# EAGLE design relay_8_v04 (EAGLE 5.11)
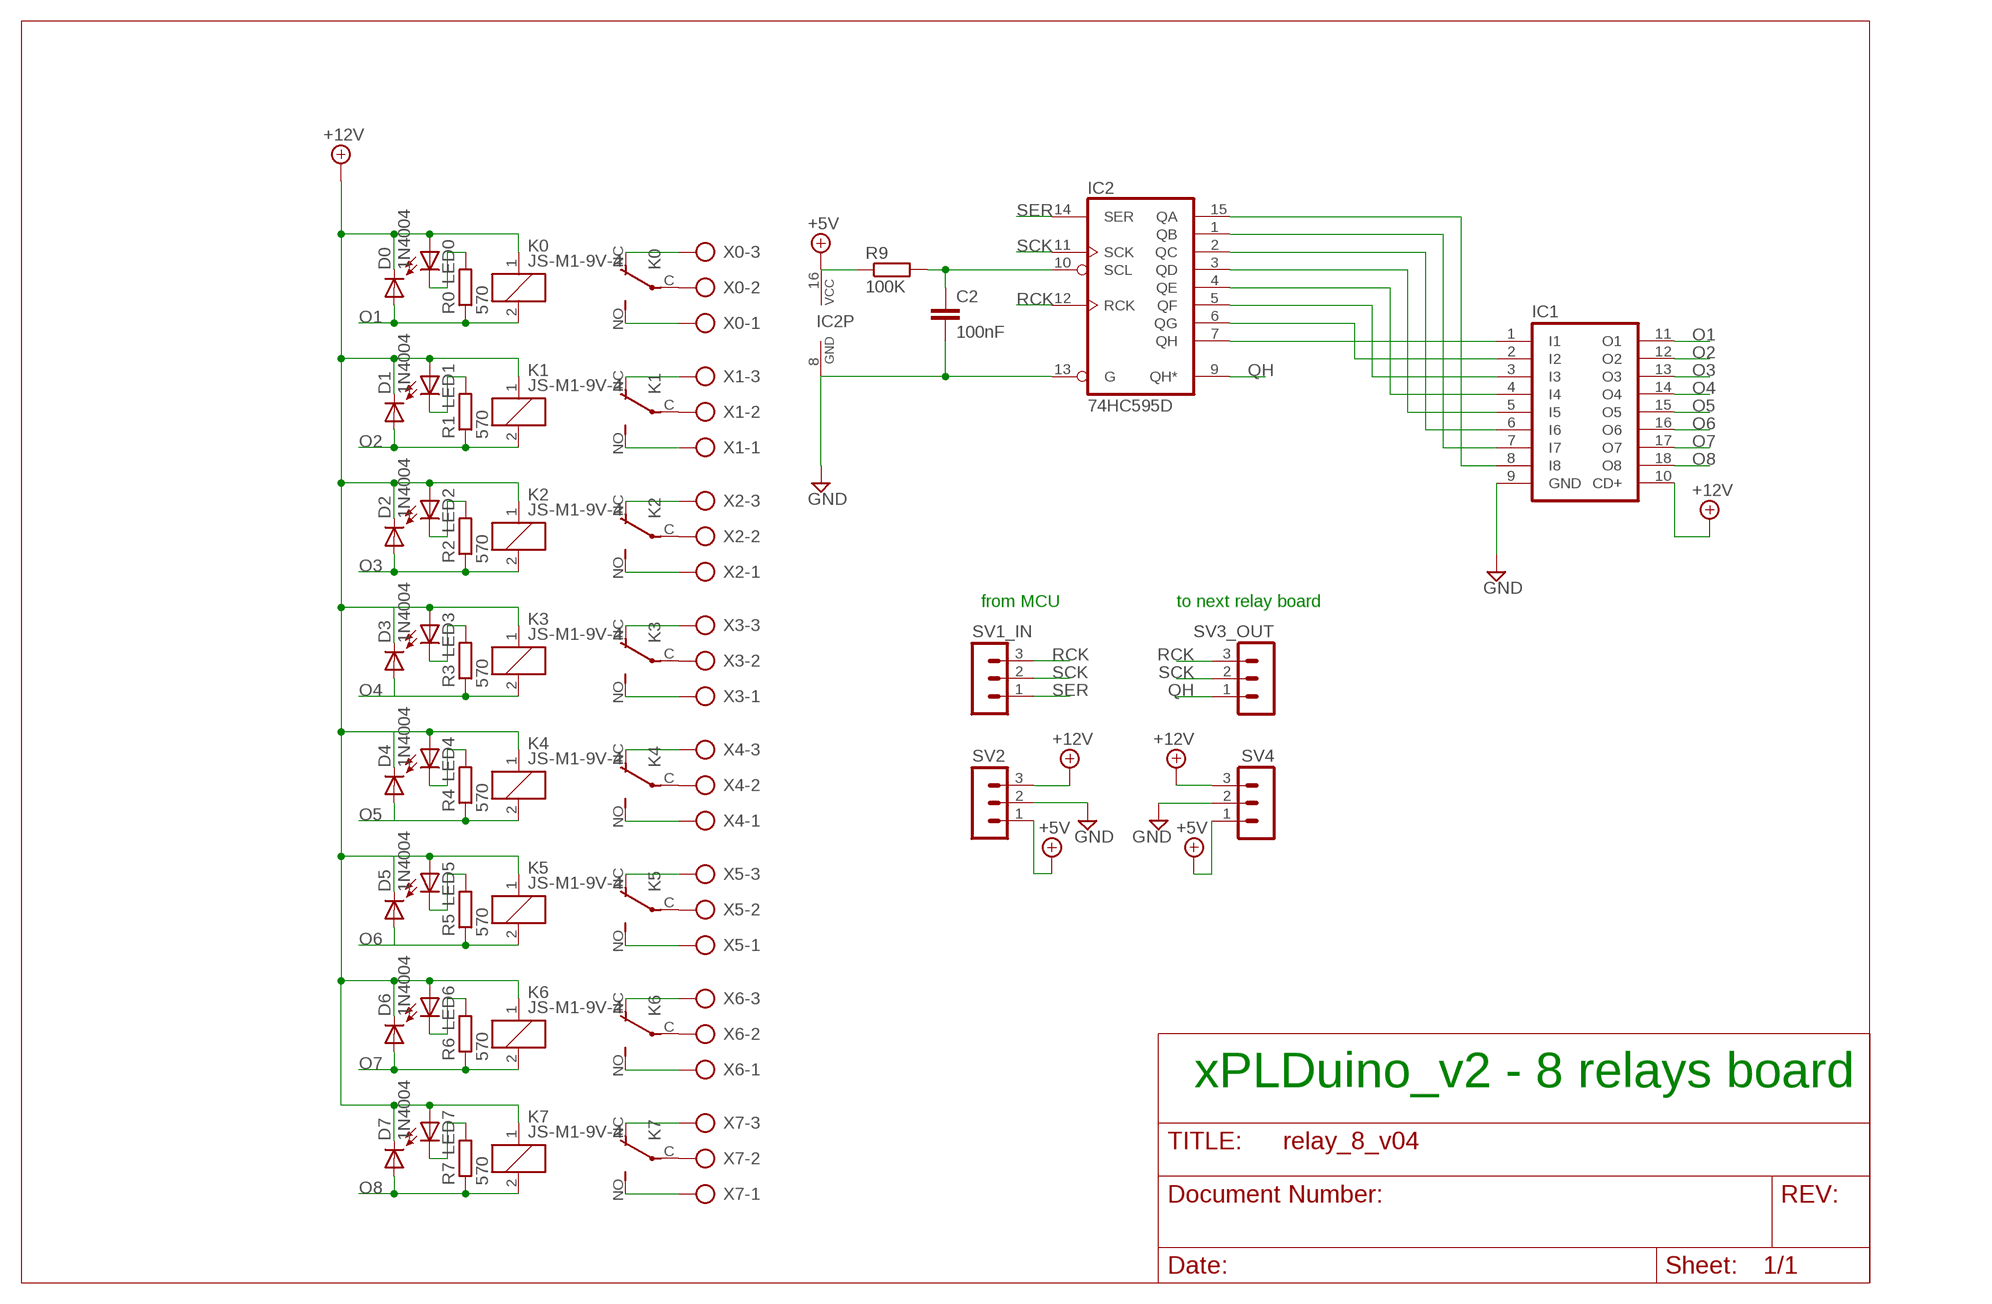
[diagram p0: schematic, sheet 1]

## Parts
C2  100nF  C-EU025-025X050  [C025-025X050]
D0  1N4004  [DO41-10]
D1  1N4004  [DO41-10]
D2  1N4004  [DO41-10]
D3  1N4004  [DO41-10]
D4  1N4004  [DO41-10]
D5  1N4004  [DO41-10]
D6  1N4004  [DO41-10]
D7  1N4004  [DO41-10]
IC1  ULN2803ASO18  [SO18W]
IC2  74HC595D  [SO16]
K0  JS-M1-9V-4  [JS-M]
K1  JS-M1-9V-4  [JS-M]
K2  JS-M1-9V-4  [JS-M]
K3  JS-M1-9V-4  [JS-M]
K4  JS-M1-9V-4  [JS-M]
K5  JS-M1-9V-4  [JS-M]
K6  JS-M1-9V-4  [JS-M]
K7  JS-M1-9V-4  [JS-M]
LED0  LED3MM  [LED3MM]
LED1  LED3MM  [LED3MM]
LED2  LED3MM  [LED3MM]
LED3  LED3MM  [LED3MM]
LED4  LED3MM  [LED3MM]
LED5  LED3MM  [LED3MM]
LED6  LED3MM  [LED3MM]
LED7  LED3MM  [LED3MM]
R0  570  R-EU_0207/2V  [0207/2V]
R1  570  R-EU_0207/2V  [0207/2V]
R2  570  R-EU_0207/2V  [0207/2V]
R3  570  R-EU_0207/2V  [0207/2V]
R4  570  R-EU_0207/2V  [0207/2V]
R5  570  R-EU_0207/2V  [0207/2V]
R6  570  R-EU_0207/2V  [0207/2V]
R7  570  R-EU_0207/2V  [0207/2V]
R9  100K  R-EU_0204/5  [0204/5]
SV1_IN  MA03-1  [MA03-1]
SV2  MA03-1  [MA03-1]
SV3_OUT  MA03-1  [MA03-1]
SV4  MA03-1  [MA03-1]
X0  AK500/3-H  [AK500/3-H]
X1  AK500/3-H  [AK500/3-H]
X2  AK500/3-H  [AK500/3-H]
X3  AK500/3-H  [AK500/3-H]
X4  AK500/3-H  [AK500/3-H]
X5  AK500/3-H  [AK500/3-H]
X6  AK500/3-H  [AK500/3-H]
X7  AK500/3-H  [AK500/3-H]

## Nets
+5V: IC2.16(VCC) R9.1 SV2.1 SV4.1
+12V: D0.C D1.C D2.C D3.C D4.C D5.C D6.C D7.C IC1.10(CD+) K0.1 K1.1 K2.1 K3.1 K4.1 K5.1 K6.1 K7.1 LED0.A LED1.A LED2.A LED3.A LED4.A LED5.A LED6.A LED7.A SV2.3 SV4.3
GND: C2.2 IC1.9(GND) IC2.8(GND) IC2.13(G) SV2.2 SV4.2
N$2: K0.C(2:P) X0.2
N$3: K0.NC(2:O) X0.3
N$4: IC1.8(I8) IC2.15(QA)
N$5: K1.NC(2:O) X1.3
N$6: K1.NO(2:S) X1.1
N$7: IC1.7(I7) IC2.1(QB)
N$8: K0.NO(2:S) X0.1
N$9: IC1.6(I6) IC2.2(QC)
N$10: IC1.5(I5) IC2.3(QD)
N$11: IC1.4(I4) IC2.4(QE)
N$12: IC1.3(I3) IC2.5(QF)
N$13: IC1.2(I2) IC2.6(QG)
N$14: IC1.1(I1) IC2.7(QH)
N$15: K1.C(2:P) X1.2
N$16: K2.NC(2:O) X2.3
N$17: K2.NO(2:S) X2.1
N$18: K2.C(2:P) X2.2
N$19: K3.NC(2:O) X3.3
N$20: K3.NO(2:S) X3.1
N$21: K3.C(2:P) X3.2
N$22: K4.NC(2:O) X4.3
N$23: K4.NO(2:S) X4.1
N$24: K4.C(2:P) X4.2
N$25: K5.NC(2:O) X5.3
N$26: K5.NO(2:S) X5.1
N$27: K5.C(2:P) X5.2
N$28: K6.NC(2:O) X6.3
N$29: K6.NO(2:S) X6.1
N$30: K6.C(2:P) X6.2
N$31: K7.NC(2:O) X7.3
N$32: K7.NO(2:S) X7.1
N$33: K7.C(2:P) X7.2
N$36: LED0.K(C) R0.2
N$37: LED1.K(C) R1.2
N$38: LED2.K(C) R2.2
N$39: LED3.K(C) R3.2
N$40: LED4.K(C) R4.2
N$41: LED5.K(C) R5.2
N$42: LED6.K(C) R6.2
N$43: LED7.K(C) R7.2
N$46: C2.1 IC2.10(SCL) R9.2
O1: D0.A IC1.11(O1) K0.2 R0.1
O2: D1.A IC1.12(O2) K1.2 R1.1
O3: D2.A IC1.13(O3) K2.2 R2.1
O4: D3.A IC1.14(O4) K3.2 R3.1
O5: D4.A IC1.15(O5) K4.2 R4.1
O6: D5.A IC1.16(O6) K5.2 R5.1
O7: D6.A IC1.17(O7) K6.2 R6.1
O8: D7.A IC1.18(O8) K7.2 R7.1
QH: IC2.9(QH*) SV3_OUT.1
RCK: IC2.12(RCK) SV1_IN.3 SV3_OUT.3
SCK: IC2.11(SCK) SV1_IN.2 SV3_OUT.2
SER: IC2.14(SER) SV1_IN.1

## Notes on the sheet
- from MCU | to next relay board
- xPLDuino_v2 - 8 relays board

## Library data of the parts
C2 = resistor:C-EU: CAPACITOR, European symbol
D0 D1-D7 = diode:1N4004: DIODE general purpose rectifier, 1 A
IC1 = xplduino-uln-udn:ULN2803A: DRIVER ARRAY
IC2 = 74xx-eu:74*595: 8-bit SHIFT REGISTER, output latch
K0 K1-K7 = relay:JS-M1*: Automotive Ultra-Miniature Power Relay NAiS Source: http://www.mew-europe.com/.. en_ds_61211_0000.pdf; OC_FARNELL: unknown; OC_NEWARK: unknown
LED0 LED1-LED7 = led:LED: LED OSRAM: - CHIPLED LG R971, LG N971, LY N971, LG Q971, LY Q971, LO R971, LY R971 LH N974, LH R974 LS Q976, LO Q976, LY Q976 LO Q996 - Hyper CHIPLED LW Q18S LB Q993, LB Q99A, LB R99A - SideLED LS A670, LO A670, LY A670, LG A670, LP A670 LB A673, LV A673, LT A673, LW A673 LH A674 LY A675 LS A676, LA A676, LO A676, LY A676, LW A676 LS A679, LY A679, LG A679 - Hyper Micro SIDELED® LS Y876, LA Y876, LO Y876, LY Y876 LT Y87S - SmartLED LW L88C, LW L88S LB L89C, LB L89S, LG L890 LS L89K, LO L89K, LY L89K LS L896, LA L896, LO L896, LY L896 - TOPLED LS T670, LO T670, LY T670, LG T670, LP T670 LSG T670, LSP T670, LSY T670, LOP T670, LYG T670 LG T671, LOG T671, LSG T671 LB T673, LV T673, LT T673, LW T673 LH T674 LS T676, LA T676, LO T676, LY T676, LB T676, LH T676, LSB T676, LW T676 LB T67C, LV T67C, LT T67C, LS T67K, LO T67K, LY T67K, LW E67C LS E67B, LA E67B, LO E67B, LY E67B, LB E67C, LV E67C, LT E67C LW T67C LS T679, LY T679, LG T679 LS T770, LO T770, LY T770, LG T770, LP T770 LB T773, LV T773, LT T773, LW T773 LH T774 LS E675, LA E675, LY E675, LS T675 LS T776, LA T776, LO T776, LY T776, LB T776 LHGB T686 LT T68C, LB T68C - Hyper Mini TOPLED® LB M676 - Mini TOPLED Santana® LG M470 LS M47K, LO M47K, LY M47K Source: http://www.osram.convergy.de LUXEON: - LUMILED® LXK2-PW12-R00, LXK2-PW12-S00, LXK2-PW14-U00, LXK2-PW14-V00 LXK2-PM12-R00, LXK2-PM12-S00, LXK2-PM14-U00 LXK2-PE12-Q00, LXK2-PE12-R00, LXK2-PE12-S00, LXK2-PE14-T00, LXK2-PE14-U00 LXK2-PB12-K00, LXK2-PB12-L00, LXK2-PB12-M00, LXK2-PB14-N00, LXK2-PB14-P00, LXK2-PB14-Q00 LXK2-PR12-L00, LXK2-PR12-M00, LXK2-PR14-Q00, LXK2-PR14-R00 LXK2-PD12-Q00, LXK2-PD12-R00, LXK2-PD12-S00 LXK2-PH12-R00, LXK2-PH12-S00 LXK2-PL12-P00, LXK2-PL12-Q00, LXK2-PL12-R00 Source: www.luxeon.com KINGBRIGHT: KA-3528ASYC Source: www.kingbright.com
R0 R1-R7 R9 = resistor:R-EU_: RESISTOR, European symbol
SV1_IN SV2 SV3_OUT SV4 = con-lstb:MA03-1: PIN HEADER; OC_FARNELL: unknown; OC_NEWARK: unknown
X0 X1-X7 = con-ptr500:AK500/3-H: CONNECTOR Aug. 2004 / PTR Meßtechnik: Die Bezeichnung der Serie AK505 wurde geändert. Es handelt sich hierbei um AK500 in horizontaler Ausführung.; OC_FARNELL: unknown; OC_NEWARK: unknown

## Board
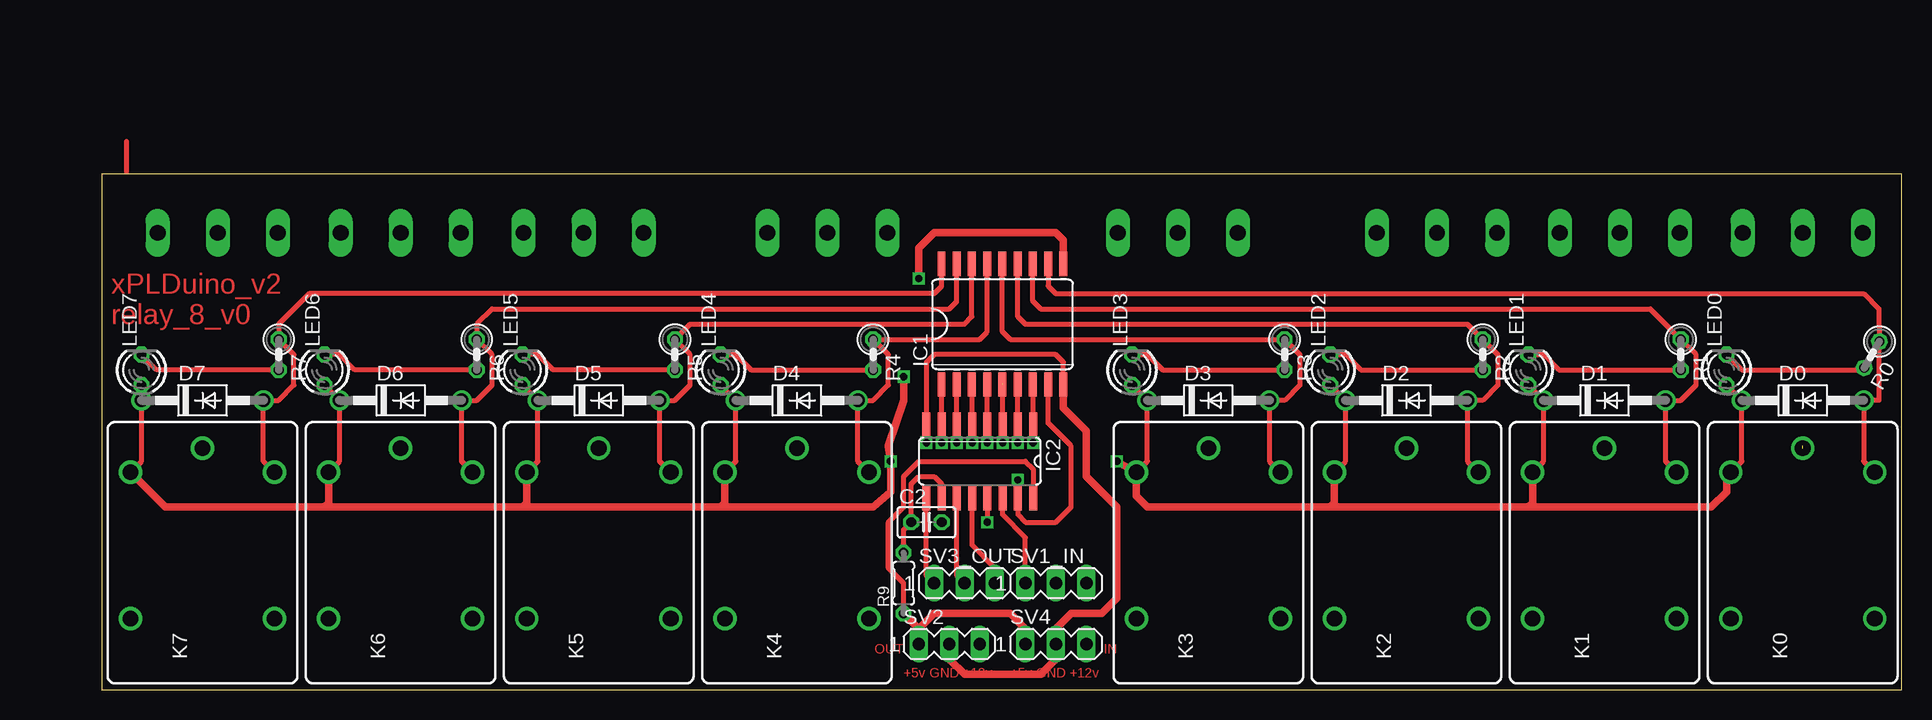
[diagram p1: board, top side]
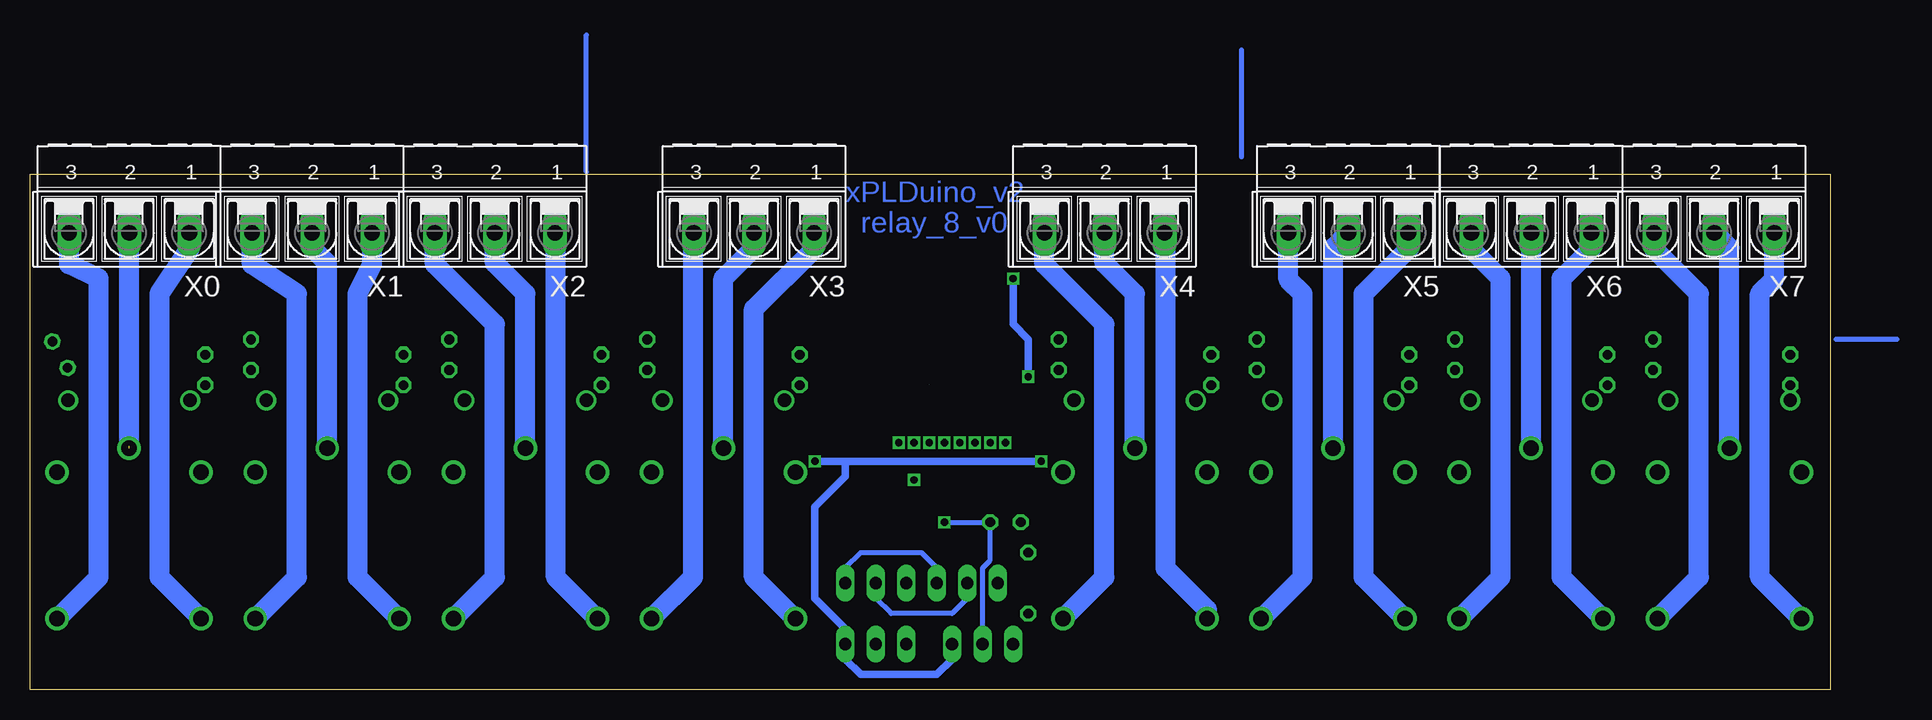
[diagram p2: board, bottom side, seen from below]

Size 150 x 43 mm. Coordinates in mm from the lower left corner, seen from the top.
Outline: 0,0 150,0 150,43 0,43 0,0
Copper layers (1*16): Top 0.035mm / dielectric 1.5mm / Bottom 0.035mm
Design rules "default": minimum track width 10mil, minimum drill 24mil, track to track 8mil, track to pad 8mil, pad to pad 8mil, via to via 8mil, smd to smd 8mil, copper to edge 40mil, drill to drill 8mil, minimum pad ring 10mil, minimum via ring 8mil, stop-mask expansion 4mil, vias tented up to drill 0mil, thermal gap 10mil

### Footprints (pad centres in the part's own frame; a part is rotated, then mirrored left to right if it is on the bottom)
C025-025X050 = drill 0.813 octagon: 1 -1.27,0; 2 1.27,0
DO41-10 = drill 1.118 round: A 5.08,0; C -5.08,0
SO18W = smd 0.66 x 2.032: 1 -5.08,-5.029; 2 -3.81,-5.029; 3 -2.54,-5.029; 4 -1.27,-5.029; 5 0,-5.029; 6 1.27,-5.029; 7 2.54,-5.029; 8 3.81,-5.029; 9 5.08,-5.029; 10 5.08,5.029; 11 3.81,5.029; 12 2.54,5.029; 13 1.27,5.029; 14 0,5.029; 15 -1.27,5.029; 16 -2.54,5.029; 17 -3.81,5.029; 18 -5.08,5.029
SO16 = smd 0.66 x 2.032: 1 -4.445,-3.073; 2 -3.175,-3.073; 3 -1.905,-3.073; 4 -0.635,-3.073; 5 0.635,-3.073; 6 1.905,-3.073; 7 3.175,-3.073; 8 4.445,-3.073; 9 4.445,3.073; 10 3.175,3.073; 11 1.905,3.073; 12 0.635,3.073; 13 -0.635,3.073; 14 -1.905,3.073; 15 -3.175,3.073; 16 -4.445,3.073
JS-M = drill 1.3 round: 1 6.7,6; 2 6.7,-6; C 8.7,0; NC -5.5,-6; NO -5.5,6
LED3MM = drill 0.813 octagon: A -1.27,0; K 1.27,0
0207/2V = drill 0.813 octagon: 1 -1.27,0; 2 1.27,0
0204/5 = drill 0.813 octagon: 1 -2.54,0; 2 2.54,0
MA03-1 = drill 1.016 long: 1 -2.54,0; 2 0,0; 3 2.54,0
AK500/3-H = drill 1.321 long: 1 -5.004,0; 2 0,0; 3 5.004,0

### Placement (x,y rotation side)
C2  68.72,13.97 0 top
D0  141.74,24.13 0 top
D1  125.23,24.13 0 top
D2  108.72,24.13 0 top
D3  92.21,24.13 0 top
D4  57.92,24.13 0 top
D5  41.41,24.13 0 top
D6  24.9,24.13 0 top
D7  8.39,24.13 0 top
IC1  75.05,30.48 0 top
IC2  73.16,19.05 180 top
K0  141.74,11.43 90 top
K1  125.23,11.43 90 top
K2  108.72,11.43 90 top
K3  92.21,11.43 90 top
K4  57.92,11.43 90 top
K5  41.41,11.43 90 top
K6  24.9,11.43 90 top
K7  8.39,11.43 90 top
LED0  135.39,26.67 90 top
LED1  118.88,26.67 90 top
LED2  102.37,26.67 90 top
LED3  85.86,26.67 90 top
LED4  51.57,26.67 90 top
LED5  35.06,26.67 90 top
LED6  18.55,26.67 90 top
LED7  3.31,26.67 90 top
R0  147.5,27.94 240 top
R1  131.58,27.94 270 top
R2  115.07,27.94 270 top
R3  98.56,27.94 270 top
R4  64.27,27.94 270 top
R5  47.76,27.94 270 top
R6  31.25,27.94 270 top
R7  14.74,27.94 270 top
R9  66.81,8.89 90 top
SV1_IN  79.51,8.89 0 top
SV2  70.62,3.81 0 top
SV3_OUT  71.89,8.89 0 top
SV4  79.51,3.81 0 top
X0  141.74,38.1 180 bottom
X1  126.5,38.1 180 bottom
X2  111.26,38.1 180 bottom
X3  89.67,38.1 180 bottom
X4  60.46,38.1 180 bottom
X5  40.14,38.1 180 bottom
X6  24.9,38.1 180 bottom
X7  9.66,38.1 180 bottom

### Tracks (layer width: path | path; a pad name or v marks a point on that pad's centre or on a via)
+5V
  Top 0.406: IC2.16 77.61,18.41 76.97,19.05 68.08,19.05 66.81,17.78 66.81,15.24 65.54,13.97 65.54,10.16 66.81,8.89 R9.1
  Top 0.61: 68.08,5.08 69.35,6.35 75.7,6.35 76.97,5.08 SV4.1 | 68.08,5.08 SV2.1 | R9.1 68.08,5.08
+12V  (via drill 0.6)
  Top 0.406: LED7.A D7.C 3.31,19.05 K7.1 | LED6.A D6.C 19.82,19.05 K6.1 | LED5.A D5.C 36.33,19.05 K5.1 | LED4.A D4.C 52.84,19.05 K4.1 | LED3.A D3.C 87.13,19.05 K3.1 | LED2.A D2.C 103.64,19.05 K2.1 | LED1.A D1.C 120.15,19.05 K1.1 | LED0.A D0.C 136.66,19.05 135.39,17.78
  Top 0.61: K7.1 5.28,15.24 18.55,15.24 | 18.55,15.24 35.06,15.24 | 35.06,15.24 51.57,15.24 | 51.57,15.24 64.27,15.24 65.73,16.51 v65.73,19.05 65.54,20.32 66.81,24.13 v66.81,26.1 | K4.1 51.92,15.59 51.57,15.24 | K5.1 35.41,15.59 35.06,15.24 | K6.1 18.9,15.59 18.55,15.24 | 102.37,15.24 87.13,15.24 86.21,16.16 K3.1 v84.59,19.05 | 102.37,15.24 118.88,15.24 | 118.88,15.24 134.12,15.24 135.39,16.51 135.39,17.78 K0.1 | K2.1 102.72,15.59 102.37,15.24 | K1.1 119.23,15.59 118.88,15.24 | IC1.10 80.13,37.48 79.51,38.1 69.35,38.1 68.08,36.83 v68.08,34.29
  Bottom 0.61: v66.81,26.1 66.81,29.21 68.08,30.48 v68.08,34.29 | v65.73,19.05 82.05,19.05 | 82.05,19.05 v84.59,19.05 | SV2.3 73.16,2.54 74.43,1.27 80.78,1.27 82.05,2.54 SV4.3 82.05,5.08 84.59,7.62 84.59,15.24 82.05,17.78 82.05,19.05
GND  (via drill 0.6)
  Top 0.406: IC2.8 68.72,27.3 69.35,27.94 79.51,27.94 80.13,27.32 IC1.9 | IC2.13 v73.8,13.97
  Top 0.61: IC1.9 80.13,23.51 82.05,21.59 82.05,17.78 84.59,15.24 84.59,7.62 83.32,6.35 80.78,6.35 79.51,5.08 SV4.2 79.51,2.54 78.24,1.27 71.89,1.27 70.62,2.54 SV2.2
  Bottom 0.406: SV2.2 70.62,10.16 69.98,10.79 C2.2 v73.8,13.97
N$1
  Bottom 0.406: -5.58,29.21 -0.5,29.21
N$2  (1 unrouted)
  Bottom 1.676: 141.74,20.32 X0.2
N$3
  Bottom 1.676: K0.NC 144.28,9.39 144.28,34.29 146.74,35.48 X0.3
N$4
  Top 0.406: IC2.15 76.33,14.61 76.97,13.97 79.51,13.97 80.78,15.24 80.78,20.32 78.86,22.24 IC1.8
N$5
  Bottom 1.676: K1.NC 127.77,9.39 127.77,33.02 131.5,35.48 X1.3
N$6
  Bottom 1.676: K1.NO 122.69,9.39 122.69,33.02 121.5,35.48 X1.1
N$7
  Top 0.406: IC1.7 77.61,25.44 IC2.1
N$8
  Bottom 1.676: K0.NO 139.2,9.39 139.2,33.02 136.66,36.83 136.66,38.1 X0.1
N$9
  Top 0.406: IC1.6 76.33,25.44 IC2.2
N$10  (1 unrouted)
  Top 0.406: IC2.3 75.06,25.44
N$11
  Top 0.406: IC1.4 73.8,25.44 IC2.4
N$12
  Top 0.406: IC1.3 72.53,25.44 IC2.5
N$13
  Top 0.406: IC1.2 71.25,25.44 IC2.6
N$14
  Top 0.406: IC1.1 69.98,25.44 IC2.7
N$15
  Bottom 1.676: K1.C 125.23,35.56 126.5,36.83 X1.2
N$16
  Bottom 1.676: K2.NC 111.26,9.39 111.26,30.48 116.26,35.48 X2.3
N$17
  Bottom 1.676: K2.NO 106.18,9.39 106.18,36.83 106.26,36.91 X2.1
N$18
  Bottom 1.676: K2.C 108.72,33.02 111.26,35.56 X2.2
N$19
  Bottom 1.676: K3.NC 94.75,9.39 94.75,38.02 X3.3
N$20
  Bottom 1.676: K3.NO 89.67,9.39 89.67,31.75 84.67,36.75 X3.1
N$21
  Bottom 1.676: K3.C 92.21,34.29 89.67,36.83 X3.2
N$22
  Bottom 1.676: K4.NC 60.46,9.39 60.46,30.48 65.46,35.48 X4.3
N$23
  Bottom 1.676: X4.1 55.38,38.02 55.38,10.16 51.92,6.7 K4.NO
N$24
  Bottom 1.676: K4.C 57.92,33.02 60.46,35.56 X4.2
N$25
  Bottom 1.676: K5.NC 43.95,9.39 43.95,33.02 45.14,34.21 X5.3
N$26
  Bottom 1.676: K5.NO 38.87,9.39 38.87,33.02 35.06,36.83 35.06,38.1 X5.1
N$27
  Bottom 1.676: X5.2 41.41,36.83 K5.C
N$28
  Bottom 1.676: K6.NC 27.44,9.39 27.44,34.29 29.9,36.75 X6.3
N$29
  Bottom 1.676: K6.NO 22.36,9.39 22.36,34.29 19.9,36.75 X6.1
N$30
  Bottom 1.676: K6.C X6.2
N$31
  Bottom 1.676: K7.NC 10.93,9.39 10.93,33.02 14.66,36.75 X7.3
N$32
  Bottom 1.676: K7.NO 5.85,9.39 5.85,33.02 4.66,34.21 X7.1
N$33
  Bottom 1.676: X7.2 8.39,36.83 K7.C
N$34
  Bottom 0.406: 49.03,44.45 49.03,53.34
N$35
  Bottom 0.406: 103.64,43.18 103.64,54.61
N$36
  Top 0.406: LED0.K 136.66,26.67 146.69,26.67 R0.2
N$37
  Top 0.406: LED1.K 120.15,27.94 121.42,26.67 R1.2
N$38
  Top 0.406: LED2.K 103.64,27.94 104.91,26.67 R2.2
N$39
  Top 0.406: LED3.K 87.13,27.94 88.4,26.67 R3.2
N$40
  Top 0.406: LED4.K 52.84,27.94 54.11,26.67 R4.2
N$41
  Top 0.406: R5.2 37.6,26.67 36.33,27.94 LED5.K
N$42
  Top 0.406: R6.2 21.09,26.67 19.82,27.94 LED6.K
N$43
  Top 0.406: R7.2 4.58,26.67 LED7.K
N$44
  Top 0.406: 2.04,45.72 2.04,43.18
N$46
  Top 0.406: IC2.10 69.98,17.14 69.35,17.78 68.08,17.78 67.44,17.14 C2.1 66.81,13.34 R9.2
N$47  (via drill 0.6)
  other vias: 68.72,20.6 69.98,20.6 71.25,20.6 72.53,20.6 73.8,20.6 75.06,20.6 76.33,20.6 77.61,20.6 76.33,17.5
O1
  Top 0.406: IC1.11 78.86,33.67 79.51,33.02 146.82,33.02 148.09,31.75 R0.1 148.09,27.94 148.09,24.13 D0.A 146.82,19.05 K0.2
O2
  Top 0.406: IC1.12 77.59,32.4 78.24,31.75 129.04,31.75 R1.1 132.85,27.94 132.85,25.4 131.58,24.13 D1.A 130.31,19.05 K1.2
O3
  Top 0.406: IC1.13 76.32,31.13 76.97,30.48 113.8,30.48 R2.1 116.34,27.94 116.34,25.4 115.07,24.13 D2.A 113.8,19.05 K2.2
O4
  Top 0.406: IC1.14 75.05,29.86 75.7,29.21 R3.1 99.83,27.94 99.83,25.4 98.56,24.13 D3.A 97.29,19.05 K3.2
O5
  Top 0.406: IC1.15 73.78,29.83 73.16,29.21 R4.1 65.54,27.94 65.54,25.4 64.27,24.13 D4.A 63,19.05 K4.2
O6
  Top 0.406: IC1.16 72.51,31.1 71.89,30.48 49.03,30.48 R5.1 49.03,27.94 49.03,25.4 47.76,24.13 D5.A 46.49,19.05 K5.2
O7
  Top 0.406: IC1.17 71.24,32.37 70.62,31.75 32.52,31.75 31.25,30.48 R6.1 32.52,27.94 32.52,25.4 31.25,24.13 D6.A 29.98,19.05 K6.2
O8
  Top 0.406: IC1.18 69.97,33.64 69.35,33.02 17.28,33.02 14.74,30.48 R7.1 16.01,27.94 16.01,25.4 14.74,24.13 D7.A 13.47,19.05 K7.2
QH
  Top 0.406: SV3_OUT.1 68.72,9.53 IC2.9
RCK
  Top 0.406: SV3_OUT.3 74.43,10.16 72.53,12.06 IC2.12
  Bottom 0.406: SV3_OUT.3 74.43,10.16 75.7,11.43 80.78,11.43 82.05,10.16 SV1_IN.3
SCK
  Top 0.406: SV3_OUT.2 71.25,9.53 IC2.11
  Bottom 0.406: SV3_OUT.2 71.89,7.62 73.16,6.35 78.24,6.35 79.51,7.62 SV1_IN.2
SER
  Top 0.406: SV1_IN.1 76.97,12.7 75.06,14.61 IC2.14

### Text on the board
Top: xPLDuino_v2 | relay_8_v0 | OUT | IN | +5v GND +12v | +5v GND +12v
Bottom: xPLDuino_v2 | relay_8_v0